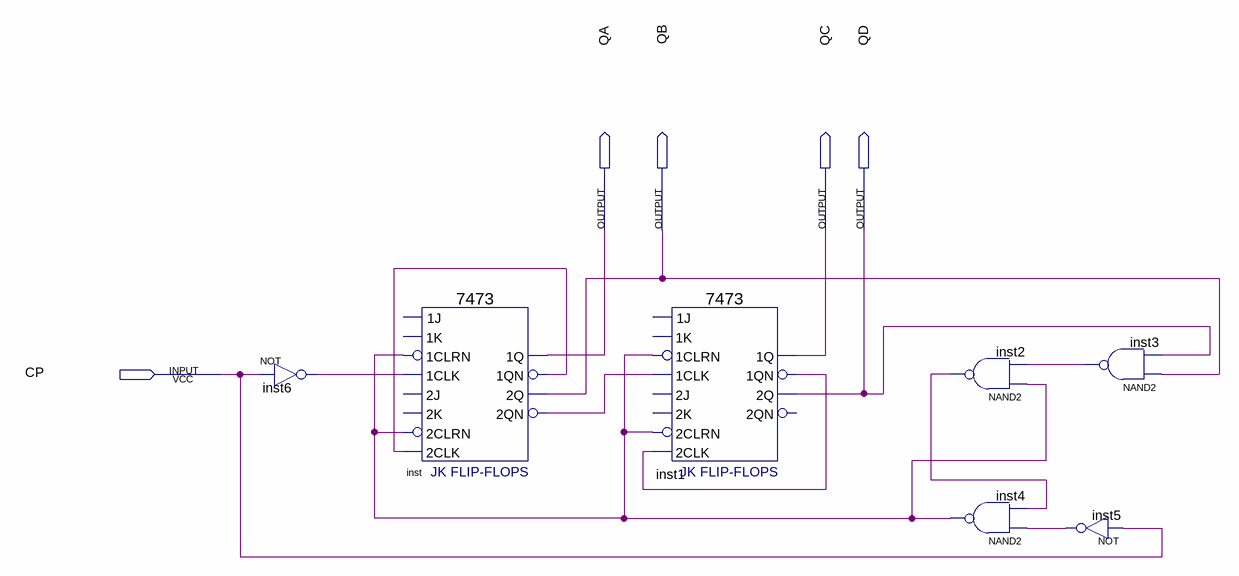
[diagram p0: schematic sheet]
// Quartus schematic pj702.bdf as structural Verilog: 7 symbols, 5 pins
module pj702 (
  input  CP,
  output QA,
  output QB,
  output QC,
  output QD
);

  wire inst1_1qn, inst2_out, inst3_out, inst4_out, inst5_out, inst6_out, inst_1qn, inst_2qn;

  not inst6 (inst6_out, CP);
  \7473  inst (
    .\1CLRN (inst4_out), .\1CLK (inst6_out), .\2CLK (inst_1qn), .\2CLRN (inst4_out), .\1QN (inst_1qn),
    .\2Q (QB), .\2QN (inst_2qn), .\1Q (QA));  // open: 1J, 1K, 2J, 2K
  \7473  inst1 (
    .\1CLRN (inst4_out), .\1CLK (inst_2qn), .\2CLK (inst1_1qn), .\2CLRN (inst4_out), .\1QN (inst1_1qn),
    .\2Q (QD), .\1Q (QC));  // open: 1J, 1K, 2J, 2K, 2QN
  nand inst2 (inst2_out, inst4_out, inst3_out);
  nand inst4 (inst4_out, inst5_out, inst2_out);
  nand inst3 (inst3_out, QB, QD);
  not inst5 (inst5_out, CP);
endmodule
